# EAGLE design GSP (EAGLE 8.7.0)
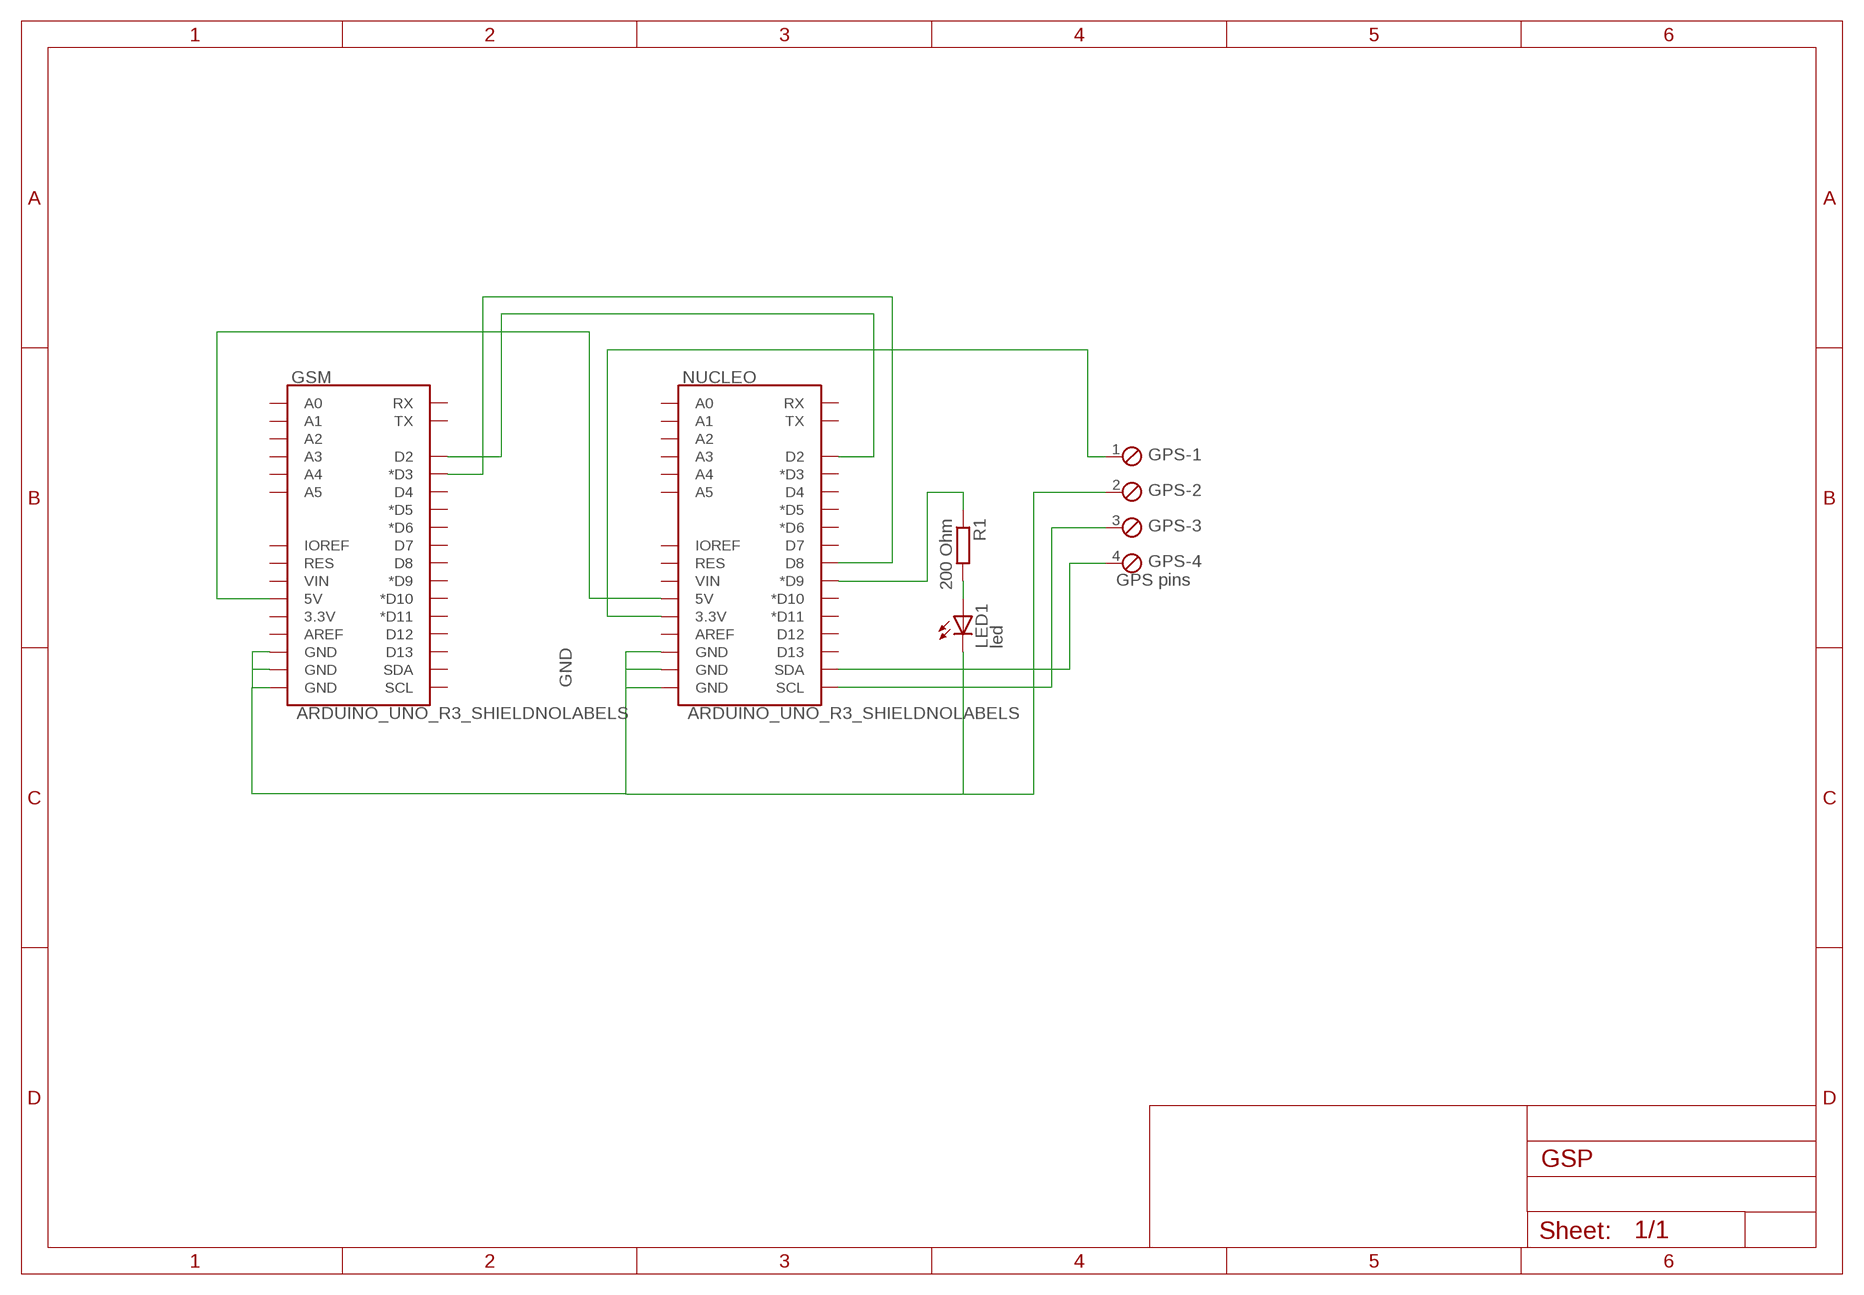
[diagram p0: schematic, sheet 1]

## Parts
GPS  GPS pins  MPT4  [4POL254]
GSM  ARDUINO_UNO_R3_SHIELDNOLABELS  [UNO_R3_SHIELD_NOLABELS]
LED1  led  LED3MM  [LED3MM]
NUCLEO  ARDUINO_UNO_R3_SHIELDNOLABELS  [UNO_R3_SHIELD_NOLABELS]
R1  200 Ohm  R-EU_0204/5  [0204/5]

## Nets
GND: GPS.2 GSM.GND@0(GND) GSM.GND@1(GND) GSM.GND@2(GND) LED1.K(C) NUCLEO.GND@0(GND) NUCLEO.GND@1(GND) NUCLEO.GND@2(GND)
N$1 [Jännite5]: GSM.5V NUCLEO.5V
N$2: NUCLEO.D9(*D9) R1.1
N$3: LED1.A R1.2
N$4 [Jännite3]: GPS.1 NUCLEO.3.3V
N$5: GSM.D2 NUCLEO.D2
N$6: GSM.D3(*D3) NUCLEO.D8
N$7: GPS.4 NUCLEO.SDA
N$8: GPS.3 NUCLEO.SCL
Unconnected: GSM.3.3V GSM.A0 GSM.A1 GSM.A2 GSM.A3 GSM.A4 GSM.A5 GSM.AREF GSM.D4 GSM.D5(*D5) GSM.D6(*D6) GSM.D7 GSM.D8 GSM.D9(*D9) GSM.D10(*D10) GSM.D11(*D11) GSM.D12 GSM.D13 GSM.IOREF GSM.RES GSM.RX GSM.SCL GSM.SDA GSM.TX GSM.VIN NUCLEO.A0 NUCLEO.A1 NUCLEO.A2 NUCLEO.A3 NUCLEO.A4 NUCLEO.A5 NUCLEO.AREF NUCLEO.D3(*D3) NUCLEO.D4 NUCLEO.D5(*D5) NUCLEO.D6(*D6) NUCLEO.D7 NUCLEO.D10(*D10) NUCLEO.D11(*D11) NUCLEO.D12 NUCLEO.D13 NUCLEO.IOREF NUCLEO.RES NUCLEO.RX NUCLEO.TX NUCLEO.VIN

## Library data of the parts
GPS = con-phoenix-254:MPT4: PHOENIX CONNECTOR; OC_FARNELL: unknown; OC_NEWARK: unknown
GSM NUCLEO = SparkFun-Boards:ARDUINO_UNO_R3_SHIELD: Arduino R3 Shield Footprint Shield form compatible with the Arduino Uno R3. SparkFun Products: MG2639 Cellular Shield <https://www.sparkfun.com/products/13120> MIDI Shield <https://www.sparkfun.com/products/12898> R3 Stackable Headers Kit <https://www.sparkfun.com/products/11417>
LED1 = adafruit:LED: LED OSRAM: - CHIPLED LG R971, LG N971, LY N971, LG Q971, LY Q971, LO R971, LY R971 LH N974, LH R974 LS Q976, LO Q976, LY Q976 LO Q996 - Hyper CHIPLED LW Q18S LB Q993, LB Q99A, LB R99A - SideLED LS A670, LO A670, LY A670, LG A670, LP A670 LB A673, LV A673, LT A673, LW A673 LH A674 LY A675 LS A676, LA A676, LO A676, LY A676, LW A676 LS A679, LY A679, LG A679 - Hyper Micro SIDELED® LS Y876, LA Y876, LO Y876, LY Y876 LT Y87S - SmartLED LW L88C, LW L88S LB L89C, LB L89S, LG L890 LS L89K, LO L89K, LY L89K LS L896, LA L896, LO L896, LY L896 - TOPLED LS T670, LO T670, LY T670, LG T670, LP T670 LSG T670, LSP T670, LSY T670, LOP T670, LYG T670 LG T671, LOG T671, LSG T671 LB T673, LV T673, LT T673, LW T673 LH T674 LS T676, LA T676, LO T676, LY T676, LB T676, LH T676, LSB T676, LW T676 LB T67C, LV T67C, LT T67C, LS T67K, LO T67K, LY T67K, LW E67C LS E67B, LA E67B, LO E67B, LY E67B, LB E67C, LV E67C, LT E67C LW T67C LS T679, LY T679, LG T679 LS T770, LO T770, LY T770, LG T770, LP T770 LB T773, LV T773, LT T773, LW T773 LH T774 LS E675, LA E675, LY E675, LS T675 LS T776, LA T776, LO T776, LY T776, LB T776 LHGB T686 LT T68C, LB T68C - Hyper Mini TOPLED® LB M676 - Mini TOPLED Santana® LG M470 LS M47K, LO M47K, LY M47K Source: http://www.osram.convergy.de/
R1 = rcl:R-EU_: RESISTOR, European symbol; SPICEPREFIX: R

## Net classes
0 default: width 0.406 mm
1 Jännite5: width 1.016 mm
2 Jännite3: width 1.016 mm

## Board
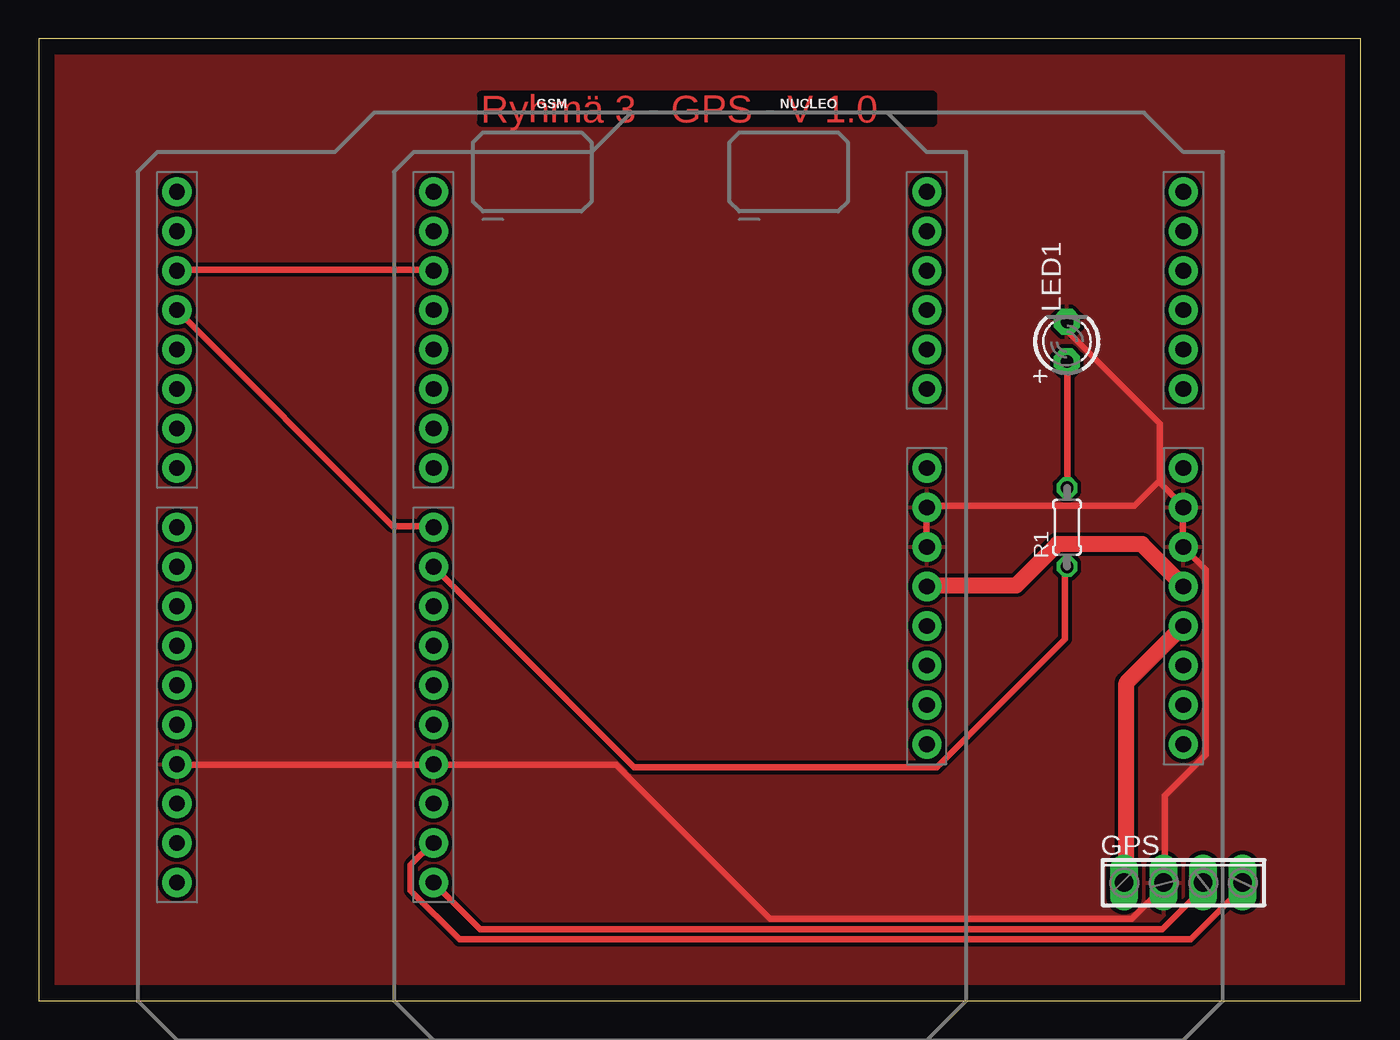
[diagram p1: board, top side]

Size 85.07 x 61.9 mm. Coordinates in mm from the lower left corner, seen from the top.
Outline: 0,0 85.07,0 85.07,61.9 0,61.9 0,0
Copper layers (1*16): Top 0.035mm / dielectric 1.5mm / Bottom 0.035mm
Design rules "default *": minimum track width 6mil, minimum drill 0.35mm, track to track 10mil, track to pad 10mil, pad to pad 10mil, via to via 10mil, smd to smd 10mil, copper to edge 40mil, drill to drill 10mil, minimum pad ring 10mil, minimum via ring 8mil, stop-mask expansion 4mil, vias tented up to drill 0mil, thermal gap 10mil

### Footprints (pad centres in the part's own frame; a part is rotated, then mirrored left to right if it is on the bottom)
4POL254 = drill 1.2 long: 1 -3.81,0; 2 -1.27,0; 3 1.27,0; 4 3.81,0
UNO_R3_SHIELD_NOLABELS = drill 1.016 pad 1.88: 3.3V 24.13,-3.81; 5V 24.13,-1.27; A0 24.13,11.43; A1 24.13,13.97; A2 24.13,16.51; A3 24.13,19.05; A4 24.13,21.59; A5 24.13,24.13; AREF -24.13,-15.24; D2 -24.13,19.05; D3 -24.13,16.51; D4 -24.13,13.97; D5 -24.13,11.43; D6 -24.13,8.89; D7 -24.13,6.35; D8 -24.13,2.54; D9 -24.13,0; D10 -24.13,-2.54; D11 -24.13,-5.08; D12 -24.13,-7.62; D13 -24.13,-10.16; GND@0 24.13,1.27; GND@1 24.13,3.81; GND@2 -24.13,-12.7; IOREF 24.13,-8.89; NC 24.13,-11.43; RES 24.13,-6.35; RX -24.13,24.13; SCL -24.13,-20.32; SDA -24.13,-17.78; TX -24.13,21.59; VIN 24.13,6.35
LED3MM = drill 0.813 pad 1.676 octagon: A -1.27,0; K 1.27,0
0204/5 = drill 0.813 octagon: 1 -2.54,0; 2 2.54,0

### Placement (x,y rotation side)
GPS  73.66,7.62 0 top
GSM  33.02,27.94 0 top
LED1  66.17,42.42 90 top
NUCLEO  49.53,27.94 0 top
R1  66.17,30.48 90 top

### Tracks (layer width: path | path; a pad name or v marks a point on that pad's centre or on a via)
GND
  Top 0.406: 72.15,33.35 72.15,37.15 66.2,43.09 66.2,43.59 66.17,43.62 LED1.K | 73.64,31.86 72.15,33.35 | 72.15,33.35 71.98,33.35 70.5,31.86 57.29,31.86 57.17,31.75 GSM.GND@1 57.12,31.7 57.12,29.22 57.14,29.21 GSM.GND@0 | NUCLEO.GND@1 73.66,31.73 73.64,31.7 73.64,29.39 73.66,29.36 NUCLEO.GND@0 73.66,29.2 75.12,27.74 75.12,15.85 72.48,13.21 72.48,7.76 72.39,7.67 GPS.2 72.39,7.51 72.31,7.43 72.31,7.26 70.33,5.28 47.05,5.28 37.15,15.19 25.59,15.19 25.54,15.24 NUCLEO.GND@2 25.31,15.24 25.26,15.19 8.91,15.19 8.89,15.21 GSM.GND@2
  pour Top: 0,61.85 85.09,61.85 85.09,0 0,0
N$1
  Top 1.016: GSM.5V 57.21,26.67 57.29,26.75 62.9,26.75 65.55,29.39 70.99,29.39 73.66,26.72 NUCLEO.5V
N$2
  Top 0.406: NUCLEO.D9 25.4,27.93 38.3,15.02 57.78,15.02 66.04,23.28 66.04,27.9 66.08,27.94 R1.1
N$3
  Top 0.406: R1.2 66.2,33.02 66.2,41.11 LED1.A
N$4
  Top 1.016: NUCLEO.3.3V 70,20.47 70,7.76 69.86,7.62 GPS.1
N$5
  Top 0.406: GSM.D2 8.89,47.03 8.91,47.05 25.26,47.05 25.32,46.99 NUCLEO.D2
N$6
  Top 0.406: GSM.D3 8.89,44.44 22.78,30.54 25.26,30.54 25.32,30.48 NUCLEO.D8
N$7
  Top 0.406: GPS.4 77.46,7.62 77.43,7.59 77.43,7.26 74.13,3.96 27.08,3.96 23.94,7.1 23.94,8.75 25.35,10.16 NUCLEO.SDA
N$8
  Top 0.406: NUCLEO.SCL 28.4,4.62 72.31,4.62 74.79,7.1 74.79,7.59 74.82,7.62 GPS.3

### Text on the board
Top: Ryhmä 3 - GPS - V 1.0